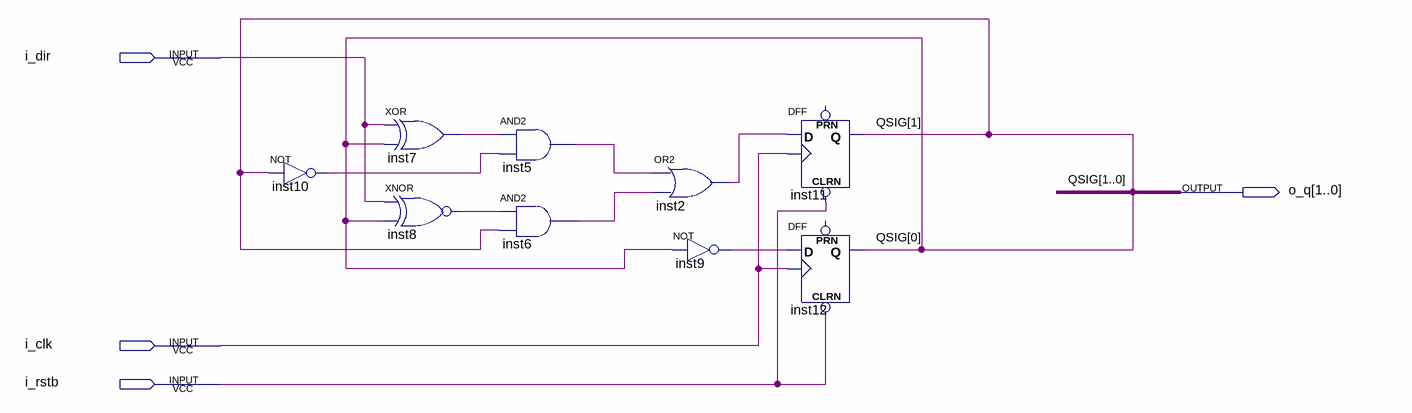
[diagram p0: schematic sheet]
// Quartus schematic counter_updn_2bit.bdf as structural Verilog: 9 symbols, 4 pins
module counter_updn_2bit (
  input  i_dir,
  input  i_clk,
  input  i_rstb,
  output [1:0] o_q
);

  wire inst2_out, inst5_out, inst6_out, inst7_out, inst8_out, inst9_out, inst10_out;

  not inst10 (inst10_out, o_q[1]);
  xor inst7 (inst7_out, i_dir, o_q[0]);
  xnor inst8 (inst8_out, i_dir, o_q[0]);
  and inst5 (inst5_out, inst7_out, inst10_out);
  and inst6 (inst6_out, inst8_out, o_q[1]);
  or inst2 (inst2_out, inst5_out, inst6_out);
  not inst9 (inst9_out, o_q[0]);
  DFF inst11 (.CLRN(i_rstb), .CLK(i_clk), .D(inst2_out), .Q(o_q[1]));  // open: PRN
  DFF inst12 (.CLRN(i_rstb), .CLK(i_clk), .D(inst9_out), .Q(o_q[0]));  // open: PRN

  // Other names for the same wires on the sheet: QSIG[1:0] = o_q
endmodule
